# EAGLE schematic untitled (EAGLE 9.6.2)
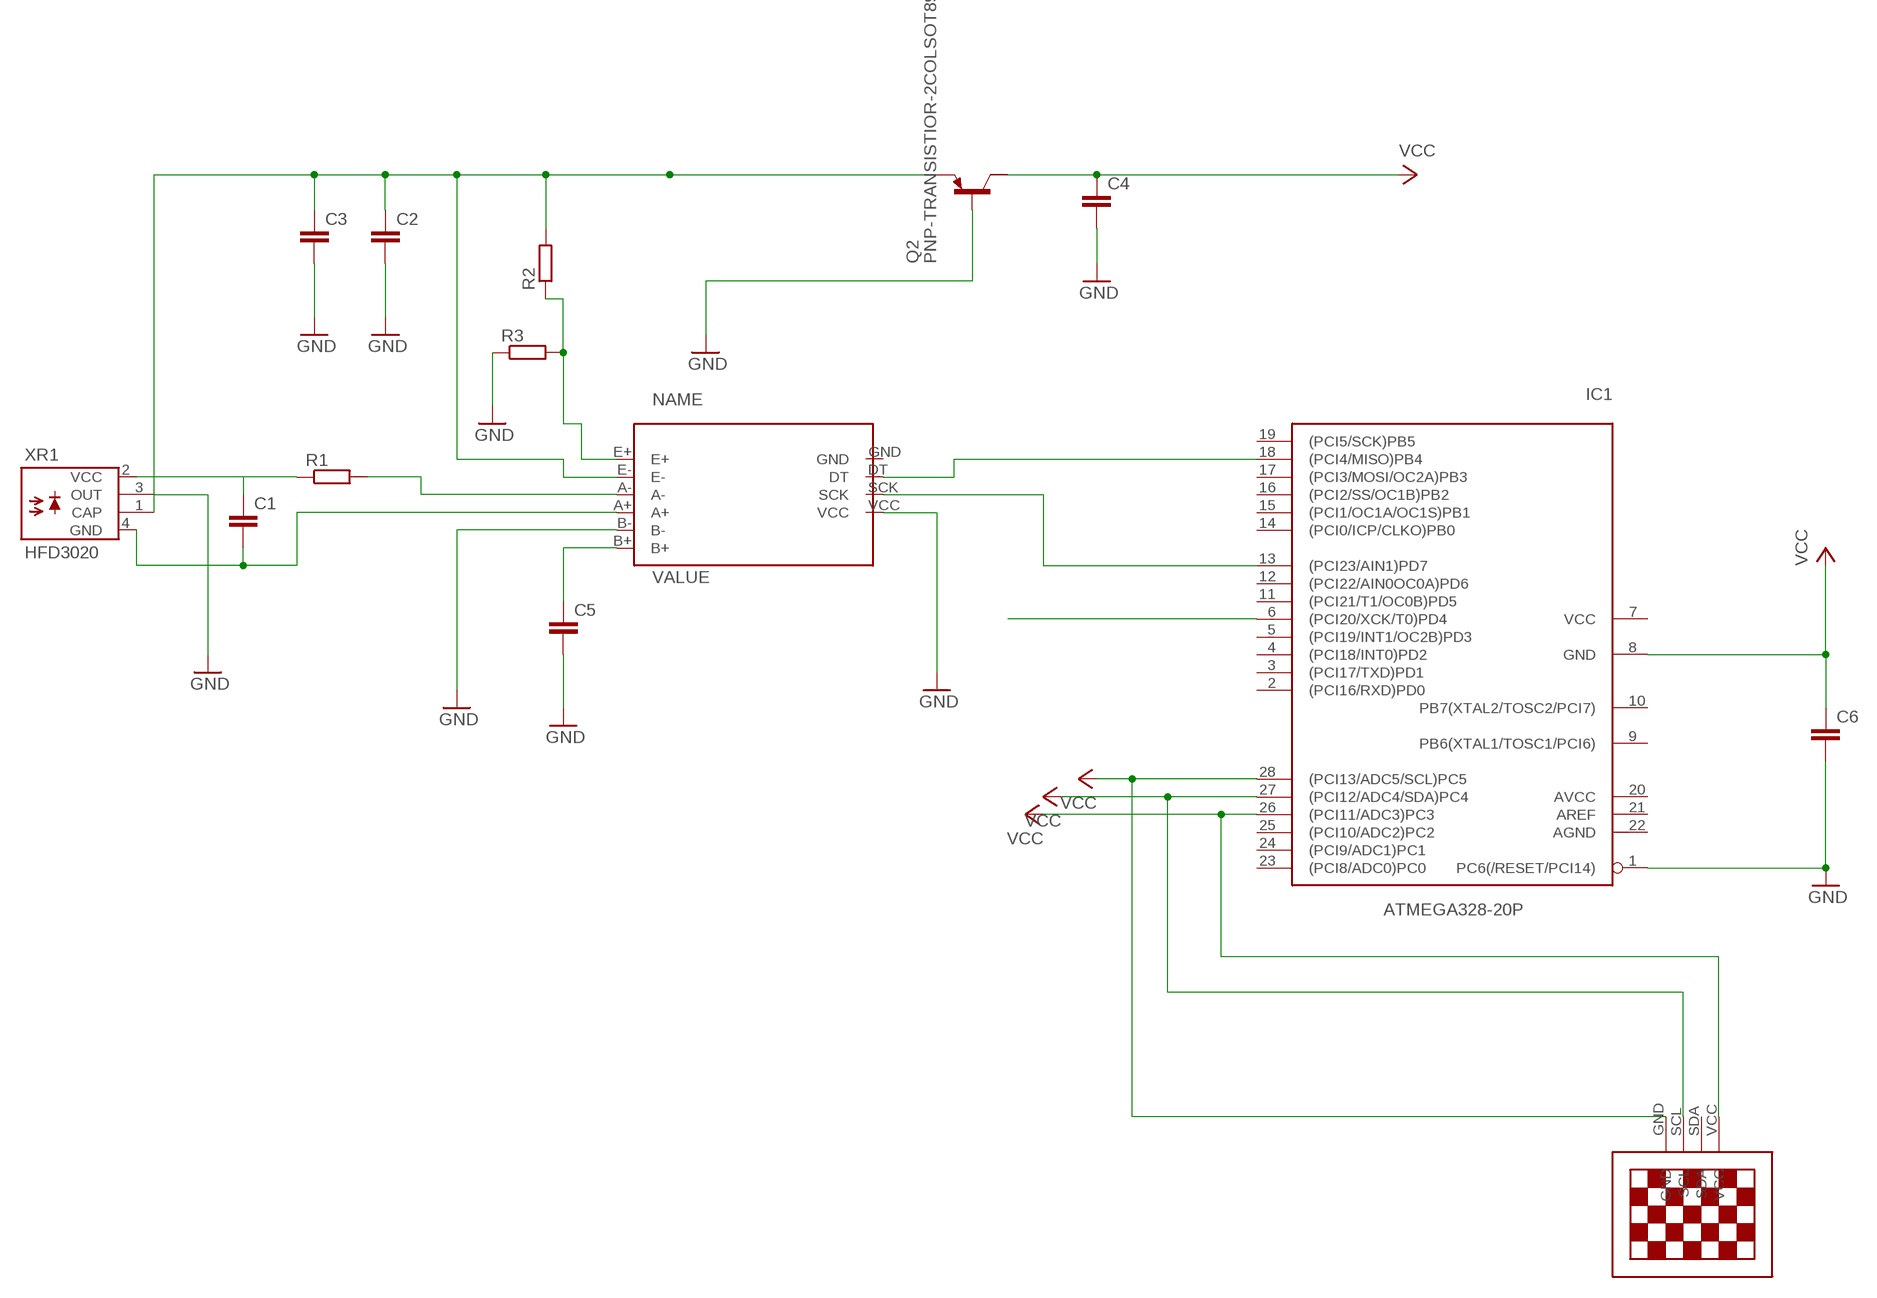
[diagram p0: schematic, sheet 1]

## Parts
C1  C2,5-3  [C2.5-3]
C2  C2,5-3  [C2.5-3]
C3  C2,5-3  [C2.5-3]
C4  C2,5-3  [C2.5-3]
C5  C2,5-3  [C2.5-3]
C6  C2,5-3  [C2.5-3]
IC1  ATMEGA328-20P  [DIL28-3]
Q2  PNP-TRANSISTIOR-2COLSOT89  [SOT89]
R1  R-EU_0204/2V  [0204V]
R2  R-EU_0204/2V  [0204V]
R3  R-EU_0204/2V  [0204V]
U$1  13"OLED13"OLED  [1.3"OLED]
U$2  HX711A  [HX711]
XR1  HFD3020  [TO18PL4]

## Nets
GND: C2.2 C3.2 C4.2 C5.2 C6.2 IC1.1(PC6(/RESET/PCI14)) Q2.1(B) R3.1 U$2.B- U$2.VCC XR1.3(OUT)
N$1: C1.2 U$2.A+ XR1.4(GND)
N$2: R1.1 XR1.2(VCC)
N$3: IC1.18((PCI4/MISO)PB4) U$2.DT
N$4: R1.2 U$2.A-
N$5: C1.1
N$6: C2.1 C3.1 Q2.3(E) R2.2 U$2.E- XR1.1(CAP)
N$7: IC1.13((PCI23/AIN1)PD7) U$2.SCK
N$9: C5.1 U$2.B+
N$10: R2.1 R3.2 U$2.E+
N$11: IC1.6((PCI20/XCK/T0)PD4)
VCC: C4.1 C6.1 IC1.8(GND) IC1.26((PCI11/ADC3)PC3) IC1.27((PCI12/ADC4/SDA)PC4) IC1.28((PCI13/ADC5/SCL)PC5) Q2.2(C) U$1.GND U$1.SCL U$1.VCC
Unconnected: IC1.2((PCI16/RXD)PD0) IC1.3((PCI17/TXD)PD1) IC1.4((PCI18/INT0)PD2) IC1.5((PCI19/INT1/OC2B)PD3) IC1.7(VCC) IC1.9(PB6(XTAL1/TOSC1/PCI6)) IC1.10(PB7(XTAL2/TOSC2/PCI7)) IC1.11((PCI21/T1/OC0B)PD5) IC1.12((PCI22/AIN0OC0A)PD6) IC1.14((PCI0/ICP/CLKO)PB0) IC1.15((PCI1/OC1A/OC1S)PB1) IC1.16((PCI2/SS/OC1B)PB2) IC1.17((PCI3/MOSI/OC2A)PB3) IC1.19((PCI5/SCK)PB5) IC1.20(AVCC) IC1.21(AREF) IC1.22(AGND) IC1.23((PCI8/ADC0)PC0) IC1.24((PCI9/ADC1)PC1) IC1.25((PCI10/ADC2)PC2) Q2.2@1(C/) U$1.SDA U$2.GND

## Library data of the parts
C1-C6 = capacitor-wima:C: CAPACITOR naming: grid - package width
IC1 = atmega328:ATMEGA328*P: MICROCONTROLLER 32 kBytes FLASH 2 kBytes SRAM 1 kBytes EEPROM USART 8-channel 10 bit ADC
Q2 = semicon-smd-ipc:PNP-TRANSISTIOR-2COL: PNP TRANSISTOR 2 colletor pins
R1-R3 = rcl:R-EU_: RESISTOR, European symbol; SPICEPREFIX: R
U$1 = 13oled:13"OLED
U$2 = HX711:HX711
XR1 = opto-honeywell:HFD3020: OPTO SENSOR DEVICE; MPN: HFD3020-500-BBA; OC_FARNELL: unknown; OC_NEWARK: 11R2885